# Altium project HSBNE-INPUT.PrjPcb
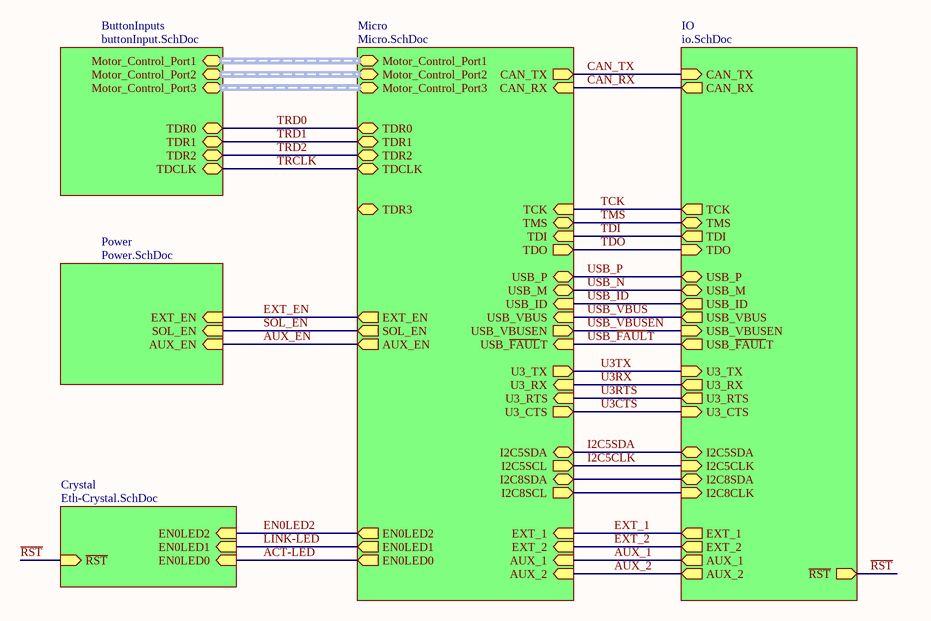
[diagram p0: Main.SchDoc]
6 sheets, 108 parts. Net scope: hierarchical (ports join the sheet entries above them; power ports are global).
Board file: HSBNE-IO.PcbDoc
Sheets:
  Main.SchDoc
    ButtonInputs = buttonInput.SchDoc
    Micro = Micro.SchDoc
    Power = Power.SchDoc
    Crystal = Eth-Crystal.SchDoc
    IO = io.SchDoc

## Sheet Main.SchDoc
size A

### Sub-sheets
ButtonInputs = buttonInput.SchDoc: Motor_Control_Port1 (harness MCP), Motor_Control_Port2 (harness MCP), Motor_Control_Port3 (harness MCP), TDR0 (bidir), TDR1 (bidir), TDR2 (bidir), TDCLK (bidir)
Crystal = Eth-Crystal.SchDoc: EN0LED0 (in), EN0LED1 (in), EN0LED2 (in), ~{RST} (in)
IO = io.SchDoc: CAN_TX (in), CAN_RX (out), TCK (out), TMS (bidir), TDI (out), TDO (in), U3_RTS (out), U3_CTS (in), U3_TX (in), U3_RX (out), USB_P (bidir), USB_M (bidir), USB_ID (out), ~{RST} (out), I2C5SDA (bidir), I2C5CLK (in), USB_VBUSEN (in), USB_~{FAUL}T (out), I2C8CLK (in), USB_VBUS (out), I2C8SDA (bidir), EXT_1 (out), AUX_1 (out), EXT_2 (out), AUX_2 (out)
Micro = Micro.SchDoc: AUX_EN (out), CAN_TX (out), CAN_RX (in), Motor_Control_Port1 (harness MCP), Motor_Control_Port2 (harness MCP), Motor_Control_Port3 (harness MCP), TCK (in), TMS (bidir), TDI (in), TDO (out), EN0LED0 (out), EN0LED1 (out), EN0LED2 (out), USB_P (bidir), USB_M (bidir), USB_ID (in), USB_VBUS (in), U3_TX (out), U3_RX (in), U3_RTS (in), U3_CTS (out), TDR3 (bidir), TDR0 (bidir), TDCLK (bidir), TDR2 (bidir), TDR1 (bidir), I2C5SDA (bidir), I2C5SCL (out), USB_VBUSEN (out), USB_~{FAUL}T (in), EXT_EN (out), SOL_EN (out), I2C8SDA (bidir), I2C8SCL (out), EXT_1 (in), EXT_2 (in), AUX_1 (in), AUX_2 (in)
Power = Power.SchDoc: AUX_EN (in), EXT_EN (in), SOL_EN (in)

### Nets
ACT-LED: sheet Micro/EN0LED0, sheet Crystal/EN0LED0
AUX_1: sheet Micro/AUX_1, sheet IO/AUX_1
AUX_2: sheet Micro/AUX_2, sheet IO/AUX_2
AUX_EN: sheet Micro/AUX_EN, sheet Power/AUX_EN
CAN_RX: sheet Micro/CAN_RX, sheet IO/CAN_RX  [project net CAN RX]
CAN_TX: sheet Micro/CAN_TX, sheet IO/CAN_TX  [project net CAN TX]
EN0LED2: sheet Micro/EN0LED2, sheet Crystal/EN0LED2
EXT_1: sheet Micro/EXT_1, sheet IO/EXT_1
EXT_2: sheet Micro/EXT_2, sheet IO/EXT_2
EXT_EN: sheet Micro/EXT_EN, sheet Power/EXT_EN
I2C5CLK: sheet Micro/I2C5SCL, sheet IO/I2C5CLK
I2C5SDA: sheet Micro/I2C5SDA, sheet IO/I2C5SDA
I2C8CLK: sheet Micro/I2C8SCL, sheet IO/I2C8CLK
I2C8SDA: sheet Micro/I2C8SDA, sheet IO/I2C8SDA
LINK-LED: sheet Micro/EN0LED1, sheet Crystal/EN0LED1
~{RST}: sheet Crystal/~{RST}, sheet IO/~{RST}
SOL_EN: sheet Micro/SOL_EN, sheet Power/SOL_EN
TCK: sheet Micro/TCK, sheet IO/TCK
TDI: sheet Micro/TDI, sheet IO/TDI
TDO: sheet Micro/TDO, sheet IO/TDO
TMS: sheet Micro/TMS, sheet IO/TMS
TRCLK: sheet ButtonInputs/TDCLK, sheet Micro/TDCLK
TRD0: sheet ButtonInputs/TDR0, sheet Micro/TDR0
TRD1: sheet ButtonInputs/TDR1, sheet Micro/TDR1
TRD2: sheet ButtonInputs/TDR2, sheet Micro/TDR2
U3CTS: sheet Micro/U3_CTS, sheet IO/U3_CTS
U3RTS: sheet Micro/U3_RTS, sheet IO/U3_RTS
U3RX: sheet Micro/U3_RX, sheet IO/U3_RX
U3TX: sheet Micro/U3_TX, sheet IO/U3_TX
USB_~{FAUL}T: sheet Micro/USB_~{FAUL}T, sheet IO/USB_~{FAUL}T  [project net ~{FAULT}]
USB_ID: sheet Micro/USB_ID, sheet IO/USB_ID
USB_N: sheet Micro/USB_M, sheet IO/USB_M
USB_P: sheet Micro/USB_P, sheet IO/USB_P
USB_VBUS: sheet Micro/USB_VBUS, sheet IO/USB_VBUS
USB_VBUSEN: sheet Micro/USB_VBUSEN, sheet IO/USB_VBUSEN

### Buses and harness runs
harness sheet ButtonInputs/Motor_Control_Port1 = sheet Micro/Motor_Control_Port1
harness sheet ButtonInputs/Motor_Control_Port2 = sheet Micro/Motor_Control_Port2
harness sheet ButtonInputs/Motor_Control_Port3 = sheet Micro/Motor_Control_Port3

## Sheet buttonInput.SchDoc
size A
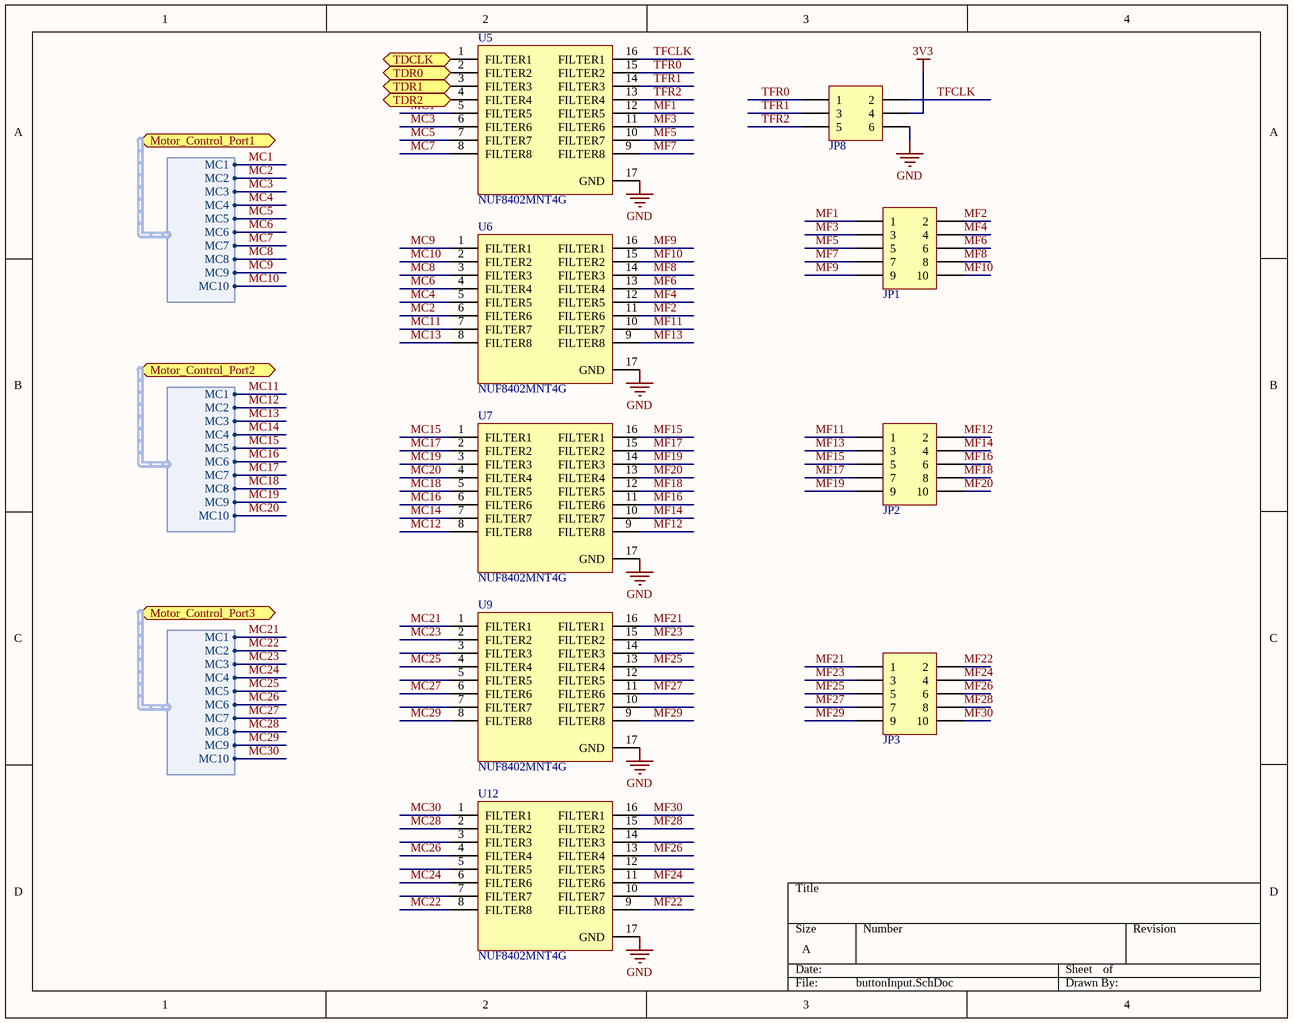
[diagram p1: buttonInput.SchDoc]

### Parts
JP1  Header 5x2 2.54mm  [2X5]  (value not drawn)
JP2  Header 5x2 2.54mm  [2X5]  (value not drawn)
JP3  Header 5x2 2.54mm  [2X5]  (value not drawn)
JP8  Header 3x2 2.54mm  [2X3]  (value not drawn)
U5  NUF8402MNT4G  [ONSC-DFN-16-506AC_V]
U6  NUF8402MNT4G  [ONSC-DFN-16-506AC_V]
U7  NUF8402MNT4G  [ONSC-DFN-16-506AC_V]
U9  NUF8402MNT4G  [ONSC-DFN-16-506AC_V]
U12  NUF8402MNT4G  [ONSC-DFN-16-506AC_V]

### Ports
Motor_Control_Port1 (harness MCP), Motor_Control_Port2 (harness MCP), Motor_Control_Port3 (harness MCP), TDCLK (bidir), TDR0 (bidir), TDR1 (bidir), TDR2 (bidir)

### Harnesses
MCP: MC1, MC2, MC3, MC4, MC5, MC6, MC7, MC8, MC9, MC10

### Nets
3V3: JP8.4
GND: JP8.6 U5.17(GND) U6.17(GND) U7.17(GND) U9.17(GND) U12.17(GND)
MC1: U5.5(FILTER5) ; port Motor_Control_Port1.MC1
MC2: U6.6(FILTER6) ; port Motor_Control_Port1.MC2
MC3: U5.6(FILTER6) ; port Motor_Control_Port1.MC3
MC4: U6.5(FILTER5) ; port Motor_Control_Port1.MC4
MC5: U5.7(FILTER7) ; port Motor_Control_Port1.MC5
MC6: U6.4(FILTER4) ; port Motor_Control_Port1.MC6
MC7: U5.8(FILTER8) ; port Motor_Control_Port1.MC7
MC8: U6.3(FILTER3) ; port Motor_Control_Port1.MC8
MC9: U6.1(FILTER1) ; port Motor_Control_Port1.MC9
MC10: U6.2(FILTER2) ; port Motor_Control_Port1.MC10
MC11: U6.7(FILTER7) ; port Motor_Control_Port2.MC1
MC12: U7.8(FILTER8) ; port Motor_Control_Port2.MC2
MC13: U6.8(FILTER8) ; port Motor_Control_Port2.MC3
MC14: U7.7(FILTER7) ; port Motor_Control_Port2.MC4
MC15: U7.1(FILTER1) ; port Motor_Control_Port2.MC5
MC16: U7.6(FILTER6) ; port Motor_Control_Port2.MC6
MC17: U7.2(FILTER2) ; port Motor_Control_Port2.MC7
MC18: U7.5(FILTER5) ; port Motor_Control_Port2.MC8
MC19: U7.3(FILTER3) ; port Motor_Control_Port2.MC9
MC20: U7.4(FILTER4) ; port Motor_Control_Port2.MC10
MC21: U9.1(FILTER1) ; port Motor_Control_Port3.MC1
MC22: U12.8(FILTER8) ; port Motor_Control_Port3.MC2
MC23: U9.2(FILTER2) ; port Motor_Control_Port3.MC3
MC24: U12.6(FILTER6) ; port Motor_Control_Port3.MC4
MC25: U9.4(FILTER4) ; port Motor_Control_Port3.MC5
MC26: U12.4(FILTER4) ; port Motor_Control_Port3.MC6
MC27: U9.6(FILTER6) ; port Motor_Control_Port3.MC7
MC28: U12.2(FILTER2) ; port Motor_Control_Port3.MC8
MC29: U9.8(FILTER8) ; port Motor_Control_Port3.MC9
MC30: U12.1(FILTER1) ; port Motor_Control_Port3.MC10
MF1: JP1.1 U5.12(FILTER5)
MF2: JP1.2 U6.11(FILTER6)
MF3: JP1.3 U5.11(FILTER6)
MF4: JP1.4 U6.12(FILTER5)
MF5: JP1.5 U5.10(FILTER7)
MF6: JP1.6 U6.13(FILTER4)
MF7: JP1.7 U5.9(FILTER8)
MF8: JP1.8 U6.14(FILTER3)
MF9: JP1.9 U6.16(FILTER1)
MF10: JP1.10 U6.15(FILTER2)
MF11: JP2.1 U6.10(FILTER7)
MF12: JP2.2 U7.9(FILTER8)
MF13: JP2.3 U6.9(FILTER8)
MF14: JP2.4 U7.10(FILTER7)
MF15: JP2.5 U7.16(FILTER1)
MF16: JP2.6 U7.11(FILTER6)
MF17: JP2.7 U7.15(FILTER2)
MF18: JP2.8 U7.12(FILTER5)
MF19: JP2.9 U7.14(FILTER3)
MF20: JP2.10 U7.13(FILTER4)
MF21: JP3.1 U9.16(FILTER1)
MF22: JP3.2 U12.9(FILTER8)
MF23: JP3.3 U9.15(FILTER2)
MF24: JP3.4 U12.11(FILTER6)
MF25: JP3.5 U9.13(FILTER4)
MF26: JP3.6 U12.13(FILTER4)
MF27: JP3.7 U9.11(FILTER6)
MF28: JP3.8 U12.15(FILTER2)
MF29: JP3.9 U9.9(FILTER8)
MF30: JP3.10 U12.16(FILTER1)
TFCLK: JP8.2 U5.16(FILTER1)
TFR0: JP8.1 U5.15(FILTER2)
TFR1: JP8.3 U5.14(FILTER3)
TFR2: JP8.5 U5.13(FILTER4)
TRCLK: U5.1(FILTER1) ; port TDCLK
TRD0: U5.2(FILTER2) ; port TDR0
TRD1: U5.3(FILTER3) ; port TDR1
TRD2: U5.4(FILTER4) ; port TDR2

Not connected (* = marked no-connect by the designer): U9 3(FILTER3) 5(FILTER5) 7(FILTER7) 10(FILTER7) 12(FILTER5) 14(FILTER3); U12 3(FILTER3) 5(FILTER5) 7(FILTER7) 10(FILTER7) 12(FILTER5) 14(FILTER3)

### Library data of the parts
JP1-JP3 = Header 5x2: Header, 8-Pin; Supplier 1: Farnell; Supplier Part Number 1: 1593440
JP8 = Header 3x2: Header, 6-Pin; Supplier 1: Digi-Key; Supplier 2: Mouser; Supplier Part Number 1: 952-1788-ND; Supplier Part Number 2: 855-M20-9980446
U5-U7 U9 U12 = CMP-1065-00001-1: 8-Channel EMI Filter with Integrated ESD Protection, -40 to 85 degC, 16-Pin DFN, Pb-Free, Tape and Reel; Manufacturer: On Semiconductor; V(BR) Typ (V): 7; Number of Lines: 8; VRWM Max (V): 5; ComponentLink3URL: http://www.onsemi.com/pub_link/Collateral/506AC.PDF; PackageVersion: Rev. D, 08/2013; RoHS: Pb-Free; ComponentLink2URL: http://www.onsemi.com/pub/Collateral/NUF8402MN-D.PDF; Packing: Tape and Reel; Mounting Technology: Surface Mount; ComponentLink1URL: http://www.onsemi.com/; PackageDescription: 16-Pin Small Outline No-Lead, Body 4 x 1.6 mm, Pitch 0.5 mm; DatasheetVersion: Rev. 7; ComponentLink3Description: Package Specification; PackageReference: DFN-16-506AC; ComponentLink2Description: Datasheet; ComponentLink1Description: Manufacturer URL; PartNumber: NUF8402MNT4G

## Sheet Micro.SchDoc
size A
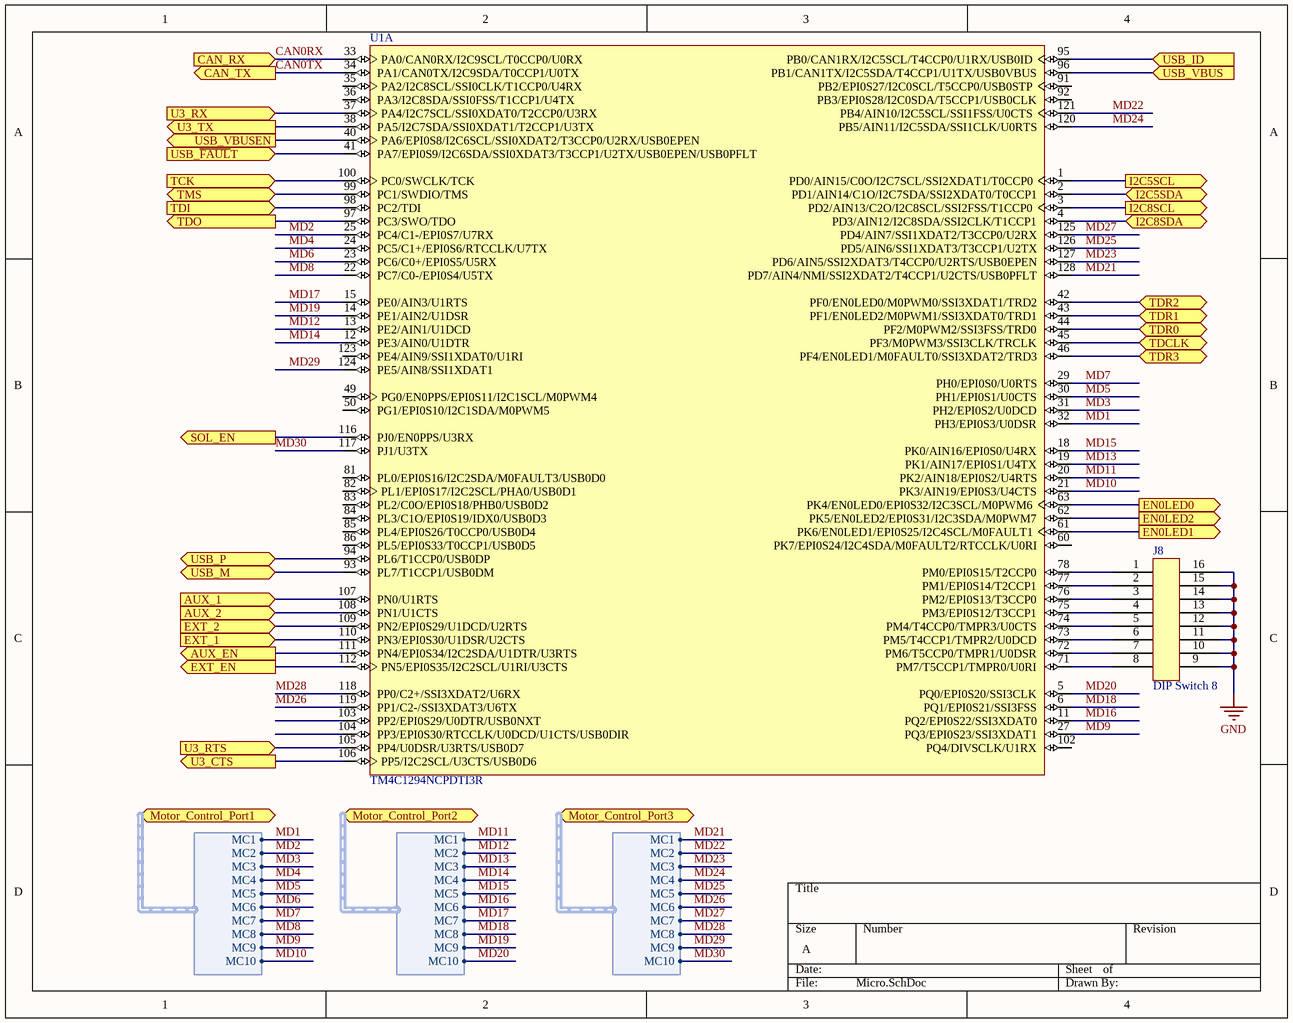
[diagram p2: Micro.SchDoc]

### Parts
J8  DIP Switch 8  [DIP8]
U1  TM4C1294NCPDTI3R  [TI-PDT128_M]  (part A of 3)

### Ports
AUX_1 (in), AUX_2 (in), AUX_EN (out), CAN_RX (in), CAN_TX (out), EN0LED0 (out), EN0LED1 (out), EN0LED2 (out), EXT_1 (in), EXT_2 (in), EXT_EN (out), I2C5SCL (out), I2C5SDA (bidir), I2C8SCL (out), I2C8SDA (bidir), Motor_Control_Port1 (harness MCP), Motor_Control_Port2 (harness MCP), Motor_Control_Port3 (harness MCP), SOL_EN (out), TCK (in), TDCLK (bidir), TDI (in), TDO (out), TDR0 (bidir), TDR1 (bidir), TDR2 (bidir), TDR3 (bidir), TMS (bidir), U3_CTS (out), U3_RTS (in), U3_RX (in), U3_TX (out), USB_ID (in), USB_M (bidir), USB_P (bidir), USB_VBUS (in), USB_VBUSEN (out), USB_~{FAUL}T (in)

### Harnesses
MCP: MC1, MC2, MC3, MC4, MC5, MC6, MC7, MC8, MC9, MC10

### Nets
GND: J8.9 J8.10 J8.11 J8.12 J8.13 J8.14 J8.15 J8.16
ACT-LED: U1.63(PK4/EN0LED0/EPI0S32/I2C3SCL/M0PWM6) ; port EN0LED0
AUX_1: U1.107(PN0/U1RTS) ; port AUX_1
AUX_2: U1.108(PN1/U1CTS) ; port AUX_2
AUX_EN: U1.111(PN4/EPI0S34/I2C2SDA/U1DTR/U3RTS) ; port AUX_EN
CAN0RX: U1.33(PA0/CAN0RX/I2C9SCL/T0CCP0/U0RX) ; port CAN_RX  [project net CAN RX]
CAN0TX: U1.34(PA1/CAN0TX/I2C9SDA/T0CCP1/U0TX) ; port CAN_TX  [project net CAN TX]
EN0LED2: U1.62(PK5/EN0LED2/EPI0S31/I2C3SDA/M0PWM7) ; port EN0LED2
EXT_1: U1.110(PN3/EPI0S30/U1DSR/U2CTS) ; port EXT_1
EXT_2: U1.109(PN2/EPI0S29/U1DCD/U2RTS) ; port EXT_2
EXT_EN: U1.112(PN5/EPI0S35/I2C2SCL/U1RI/U3CTS) ; port EXT_EN
~{FAULT}: U1.41(PA7/EPI0S9/I2C6SDA/SSI0XDAT3/T3CCP1/U2TX/USB0EPEN/USB0PFLT) ; port USB_~{FAUL}T
I2C5CLK: U1.1(PD0/AIN15/C0O/I2C7SCL/SSI2XDAT1/T0CCP0) ; port I2C5SCL
I2C5SDA: U1.2(PD1/AIN14/C1O/I2C7SDA/SSI2XDAT0/T0CCP1) ; port I2C5SDA
I2C8CLK: U1.3(PD2/AIN13/C2O/I2C8SCL/SSI2FSS/T1CCP0) ; port I2C8SCL
I2C8SDA: U1.4(PD3/AIN12/I2C8SDA/SSI2CLK/T1CCP1) ; port I2C8SDA
LINK-LED: U1.61(PK6/EN0LED1/EPI0S25/I2C4SCL/M0FAULT1) ; port EN0LED1
MD1: U1.32(PH3/EPI0S3/U0DSR) ; port Motor_Control_Port1.MC1  [project net MC1]
MD2: U1.25(PC4/C1-/EPI0S7/U7RX) ; port Motor_Control_Port1.MC2  [project net MC2]
MD3: U1.31(PH2/EPI0S2/U0DCD) ; port Motor_Control_Port1.MC3  [project net MC3]
MD4: U1.24(PC5/C1+/EPI0S6/RTCCLK/U7TX) ; port Motor_Control_Port1.MC4  [project net MC4]
MD5: U1.30(PH1/EPI0S1/U0CTS) ; port Motor_Control_Port1.MC5  [project net MC5]
MD6: U1.23(PC6/C0+/EPI0S5/U5RX) ; port Motor_Control_Port1.MC6  [project net MC6]
MD7: U1.29(PH0/EPI0S0/U0RTS) ; port Motor_Control_Port1.MC7  [project net MC7]
MD8: U1.22(PC7/C0-/EPI0S4/U5TX) ; port Motor_Control_Port1.MC8  [project net MC8]
MD9: U1.27(PQ3/EPI0S23/SSI3XDAT1) ; port Motor_Control_Port1.MC9  [project net MC9]
MD10: U1.21(PK3/AIN19/EPI0S3/U4CTS) ; port Motor_Control_Port1.MC10  [project net MC10]
MD11: U1.20(PK2/AIN18/EPI0S2/U4RTS) ; port Motor_Control_Port2.MC1  [project net MC11]
MD12: U1.13(PE2/AIN1/U1DCD) ; port Motor_Control_Port2.MC2  [project net MC12]
MD13: U1.19(PK1/AIN17/EPI0S1/U4TX) ; port Motor_Control_Port2.MC3  [project net MC13]
MD14: U1.12(PE3/AIN0/U1DTR) ; port Motor_Control_Port2.MC4  [project net MC14]
MD15: U1.18(PK0/AIN16/EPI0S0/U4RX) ; port Motor_Control_Port2.MC5  [project net MC15]
MD16: U1.11(PQ2/EPI0S22/SSI3XDAT0) ; port Motor_Control_Port2.MC6  [project net MC16]
MD17: U1.15(PE0/AIN3/U1RTS) ; port Motor_Control_Port2.MC7  [project net MC17]
MD18: U1.6(PQ1/EPI0S21/SSI3FSS) ; port Motor_Control_Port2.MC8  [project net MC18]
MD19: U1.14(PE1/AIN2/U1DSR) ; port Motor_Control_Port2.MC9  [project net MC19]
MD20: U1.5(PQ0/EPI0S20/SSI3CLK) ; port Motor_Control_Port2.MC10  [project net MC20]
MD21: U1.128(PD7/AIN4/NMI/SSI2XDAT2/T4CCP1/U2CTS/USB0PFLT) ; port Motor_Control_Port3.MC1  [project net MC21]
MD22: U1.121(PB4/AIN10/I2C5SCL/SSI1FSS/U0CTS) ; port Motor_Control_Port3.MC2  [project net MC22]
MD23: U1.127(PD6/AIN5/SSI2XDAT3/T4CCP0/U2RTS/USB0EPEN) ; port Motor_Control_Port3.MC3  [project net MC23]
MD24: U1.120(PB5/AIN11/I2C5SDA/SSI1CLK/U0RTS) ; port Motor_Control_Port3.MC4  [project net MC24]
MD25: U1.126(PD5/AIN6/SSI1XDAT3/T3CCP1/U2TX) ; port Motor_Control_Port3.MC5  [project net MC25]
MD26: U1.119(PP1/C2-/SSI3XDAT3/U6TX) ; port Motor_Control_Port3.MC6  [project net MC26]
MD27: U1.125(PD4/AIN7/SSI1XDAT2/T3CCP0/U2RX) ; port Motor_Control_Port3.MC7  [project net MC27]
MD28: U1.118(PP0/C2+/SSI3XDAT2/U6RX) ; port Motor_Control_Port3.MC8  [project net MC28]
MD29: U1.124(PE5/AIN8/SSI1XDAT1) ; port Motor_Control_Port3.MC9  [project net MC29]
MD30: U1.117(PJ1/U3TX) ; port Motor_Control_Port3.MC10  [project net MC30]
SOL_EN: U1.116(PJ0/EN0PPS/U3RX) ; port SOL_EN
TCK: U1.100(PC0/SWCLK/TCK) ; port TCK
TDI: U1.98(PC2/TDI) ; port TDI
TDO: U1.97(PC3/SWO/TDO) ; port TDO
TMS: U1.99(PC1/SWDIO/TMS) ; port TMS
TRCLK: U1.45(PF3/M0PWM3/SSI3CLK/TRCLK) ; port TDCLK
TRD0: U1.44(PF2/M0PWM2/SSI3FSS/TRD0) ; port TDR0
TRD1: U1.43(PF1/EN0LED2/M0PWM1/SSI3XDAT0/TRD1) ; port TDR1
TRD2: U1.42(PF0/EN0LED0/M0PWM0/SSI3XDAT1/TRD2) ; port TDR2
U3CTS: U1.106(PP5/I2C2SCL/U3CTS/USB0D6) ; port U3_CTS
U3RTS: U1.105(PP4/U0DSR/U3RTS/USB0D7) ; port U3_RTS
U3RX: U1.37(PA4/I2C7SCL/SSI0XDAT0/T2CCP0/U3RX) ; port U3_RX
U3TX: U1.38(PA5/I2C7SDA/SSI0XDAT1/T2CCP1/U3TX) ; port U3_TX
USB_ID: U1.95(PB0/CAN1RX/I2C5SCL/T4CCP0/U1RX/USB0ID) ; port USB_ID
USB_N: U1.93(PL7/T1CCP1/USB0DM) ; port USB_M
USB_P: U1.94(PL6/T1CCP0/USB0DP) ; port USB_P
USB_VBUS: U1.96(PB1/CAN1TX/I2C5SDA/T4CCP1/U1TX/USB0VBUS) ; port USB_VBUS
USB_VBUSEN: U1.40(PA6/EPI0S8/I2C6SCL/SSI0XDAT2/T3CCP0/U2RX/USB0EPEN) ; port USB_VBUSEN
NetJ8_1: J8.1 U1.78(PM0/EPI0S15/T2CCP0)
NetJ8_2: J8.2 U1.77(PM1/EPI0S14/T2CCP1)
NetJ8_3: J8.3 U1.76(PM2/EPI0S13/T3CCP0)
NetJ8_4: J8.4 U1.75(PM3/EPI0S12/T3CCP1)
NetJ8_5: J8.5 U1.74(PM4/T4CCP0/TMPR3/U0CTS)
NetJ8_6: J8.6 U1.73(PM5/T4CCP1/TMPR2/U0DCD)
NetJ8_7: J8.7 U1.72(PM6/T5CCP0/TMPR1/U0DSR)
NetJ8_8: J8.8 U1.71(PM7/T5CCP1/TMPR0/U0RI)
NetU1_46: U1.46(PF4/EN0LED1/M0FAULT0/SSI3XDAT2/TRD3) ; port TDR3

Not connected (* = marked no-connect by the designer): U1 35(PA2/I2C8SCL/SSI0CLK/T1CCP0/U4RX) 36(PA3/I2C8SDA/SSI0FSS/T1CCP1/U4TX) 49(PG0/EN0PPS/EPI0S11/I2C1SCL/M0PWM4) 50(PG1/EPI0S10/I2C1SDA/M0PWM5) 60(PK7/EPI0S24/I2C4SDA/M0FAULT2/RTCCLK/U0RI) 81(PL0/EPI0S16/I2C2SDA/M0FAULT3/USB0D0) 82(PL1/EPI0S17/I2C2SCL/PHA0/USB0D1) 83(PL2/C0O/EPI0S18/PHB0/USB0D2) 84(PL3/C1O/EPI0S19/IDX0/USB0D3) 85(PL4/EPI0S26/T0CCP0/USB0D4) 86(PL5/EPI0S33/T0CCP1/USB0D5) 91(PB2/EPI0S27/I2C0SCL/T5CCP0/USB0STP) 92(PB3/EPI0S28/I2C0SDA/T5CCP1/USB0CLK) 102(PQ4/DIVSCLK/U1RX) 103(PP2/EPI0S29/U0DTR/USB0NXT) 104(PP3/EPI0S30/RTCCLK/U0DCD/U1CTS/USB0DIR) 123(PE4/AIN9/SSI1XDAT0/U1RI)

### Library data of the parts
J8 = DIP8: Supplier 1: Digikey; Supplier Part Number 1: CT3111-ND
U1 = CMP-0945-00007-1: Tiva C Series Microcontroller, 1024 KB Flash, 256 KB SRAM, 12 Bit, 20 Channels, -40 to 85 degC, 128-Pin TQFP (PDT), Green (RoHS & no Sb/Br), Tape and Reel; Manufacturer: Texas Instruments; SRAM: 256 KB; ADC Resolution: 12 Bits; ADC Channels: 20; Flash: 1024 KB; Max Speed: 120 MHz; CPU: ARM Cortex-M4; Packing: Tape and Reel; Mounting Technology: Surface Mount; Eco-Plan: Green (RoHS & no Sb/Br); ComponentLink1URL: http://www.ti.com/; ComponentLink3Description: Package Specification; ComponentLink2Description: Datasheet; PartNumber: TM4C1294NCPDTI3R; DatasheetVersion: 15863.2743; ComponentLink1Description: Manufacturer URL; ComponentLink3URL: http://www.ti.com/lit/ml/mpqf013/mpqf013.pdf; Temperature Range: -40 to 85 degC; ComponentLink2URL: http://www.ti.com/lit/ds/symlink/tm4c1294ncpdt.pdf; PackageVersion: 4087726/A; PackageDescription: 128-Pin Thin Quad Flat Package, Body 14 x 14 mm, Pitch 0.4 mm

## Sheet Power.SchDoc
size A
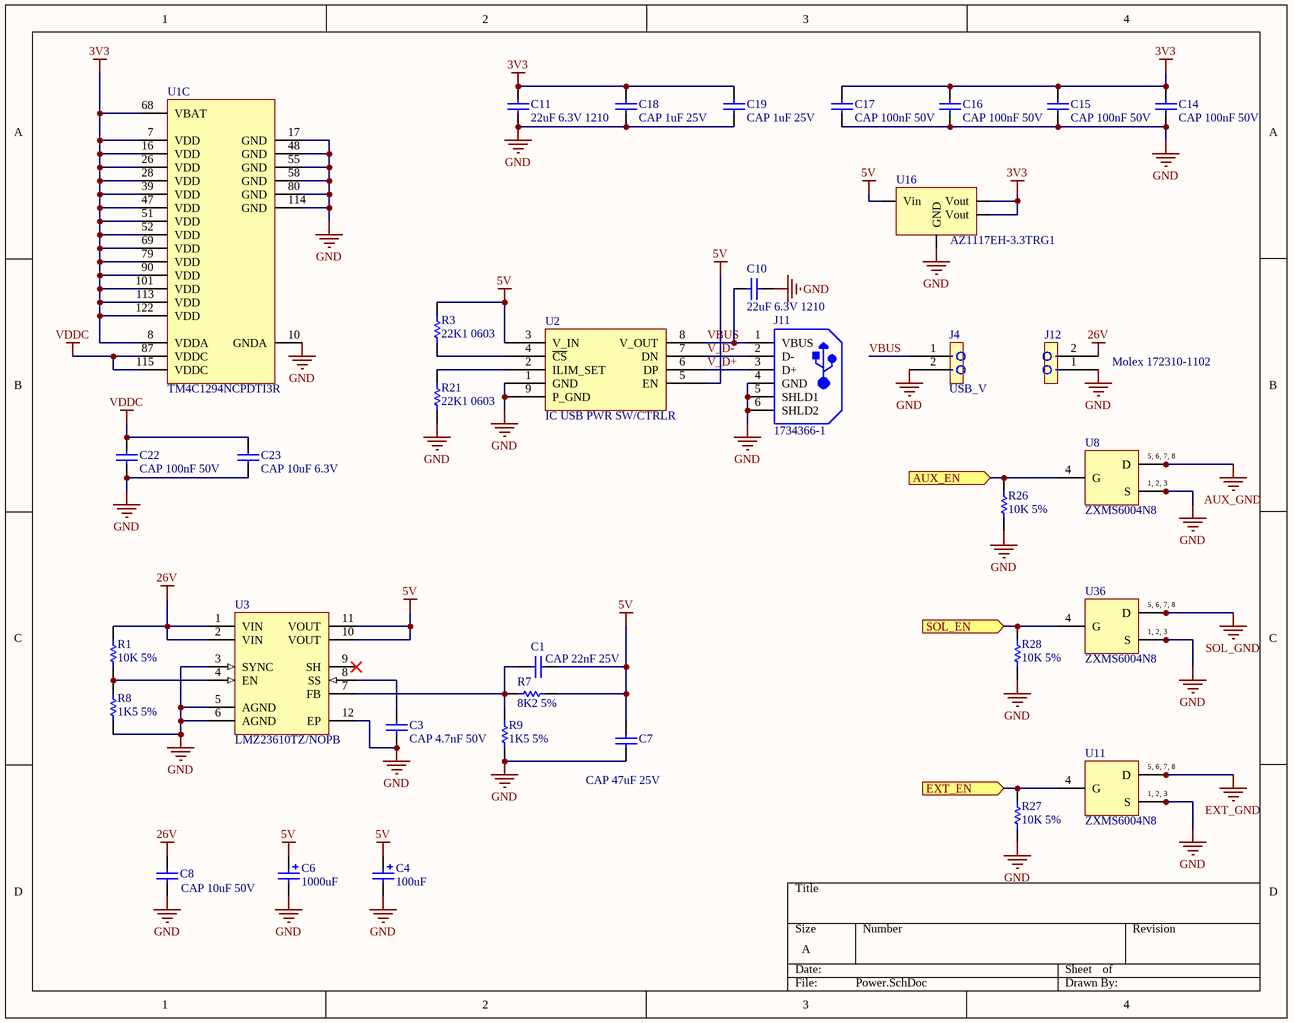
[diagram p3: Power.SchDoc]

### Parts
C1  CAP 22nF 25V  [CAPC0805(2012)100_M]
C3  CAP 4.7nF 50V  [CAPC0603(1608)100_M]
C4  100uF  [PANASONIC_C]
C6  1000uF  [PANASONIC_H13]
C7  CAP 47uF 25V  [CAPC1206(3216)100_L]
C8  CAP 10uF 50V  [CAPC1206(3216)190_M]
C10  22uF 6.3V 1210  [CAPC1210(3225)220_N]
C11  22uF 6.3V 1210  [CAPC1210(3225)220_N]
C14  CAP 100nF 50V  [CAPC0603(1608)100_M]
C15  CAP 100nF 50V  [CAPC0603(1608)100_M]
C16  CAP 100nF 50V  [CAPC0603(1608)100_M]
C17  CAP 100nF 50V  [CAPC0603(1608)100_M]
C18  CAP 1uF 25V  [CAPC0603(1608)100_M]
C19  CAP 1uF 25V  [CAPC0603(1608)100_M]
C22  CAP 100nF 50V  [CAPC0603(1608)100_M]
C23  CAP 10uF 6.3V  [CAPC0603(1608)100_M]
J4  USB_V  [1X2]
J11  1734366-1  [TE-1734366-1_V]
J12  Molex 172310-1102  [Molex 172310-1102]
R1  10K 5%  [RESC0603(1608)_M]
R3  22K1 0603  [RESC0603(1608)_N]
R7  8K2 5%  [RESC0603(1608)_M]
R8  1K5 5%  [RESC0603(1608)_M]
R9  1K5 5%  [RESC0603(1608)_M]
R21  22K1 0603  [RESC0603(1608)_N]
R26  10K 5%  [RESC0603(1608)_N]
R27  10K 5%  [RESC0603(1608)_N]
R28  10K 5%  [RESC0603(1608)_N]
U1  TM4C1294NCPDTI3R  [TI-PDT128_M]  (part C of 3)
U2  IC USB PWR SW/CTRLR  [8-MSOP-PowerPad]
U3  LMZ23610TZ/NOPB  [NDY0011A_M]
U8  ZXMS6004N8  [SO-8]
U11  ZXMS6004N8  [SO-8]
U16  AZ1117EH-3.3TRG1  [SOT-223]
U36  ZXMS6004N8  [SO-8]

### Ports
AUX_EN (in), EXT_EN (in), SOL_EN (in)

### Nets
3V3: C11.2 C14.2 C15.2 C16.2 C17.2 C18.2 C19.2 U1.7(VDD) U1.8(VDDA) U1.16(VDD) U1.26(VDD) U1.28(VDD) U1.39(VDD) U1.47(VDD) U1.51(VDD) U1.52(VDD) U1.68(VBAT) U1.69(VDD) U1.79(VDD) U1.90(VDD) U1.101(VDD) U1.113(VDD) U1.122(VDD) U16.2(Vout) U16.4(Vout)
5V: C1.2 C4.+ C6.+ C7.1 R3.1 R7.1 U2.3(V_IN) U2.5(EN) U3.10(VOUT) U3.11(VOUT) U16.3(Vin)
26V: C8.1 J12.2 R1.2 U3.1(VIN) U3.2(VIN)
AUX_GND: U8.5(D) U8.6(D) U8.7(D) U8.8(D)
EXT_GND: U11.5(D) U11.6(D) U11.7(D) U11.8(D)
GND: C3.1 C4.- C6.- C7.2 C8.2 C10.2 C11.1 C14.1 C15.1 C16.1 C17.1 C18.1 C19.1 C22.1 C23.1 J4.2 J11.4(GND) J11.5(SHLD1) J11.6(SHLD2) J12.1 R8.1 R9.1 R21.1 R26.1 R27.1 R28.1 U1.10(GNDA) U1.17(GND) U1.48(GND) U1.55(GND) U1.58(GND) U1.80(GND) U1.114(GND) U2.1(GND) U2.9(P_GND) U3.3(SYNC) U3.5(AGND) U3.6(AGND) U3.12(EP) U8.1(S) U8.2(S) U8.3(S) U11.1(S) U11.2(S) U11.3(S) U16.1(GND) U36.1(S) U36.2(S) U36.3(S)
SOL_GND: U36.5(D) U36.6(D) U36.7(D) U36.8(D)
VDDC: C22.2 C23.2 U1.87(VDDC) U1.115(VDDC)
AUX_EN: R26.2 U8.4(G) ; port AUX_EN
EXT_EN: R27.2 U11.4(G) ; port EXT_EN
SOL_EN: R28.2 U36.4(G) ; port SOL_EN
V_D+: J11.3(D+) U2.6(DP)
V_D-: J11.2(D-) U2.7(DN)
VBUS: C10.1 J4.1 J11.1(VBUS) U2.8(V_OUT)
NetC1_1: C1.1 R7.2 R9.2 U3.7(FB)
NetC3_2: C3.2 U3.8(SS)
NetR1_1: R1.1 R8.2 U3.4(EN)
NetR3_2: R3.2 U2.4(~{CS})
NetR21_2: R21.2 U2.2(ILIM_SET)

Not connected (* = marked no-connect by the designer): U3 9(SH)*

### Notes on the sheet
- (in symbol ZXMS6004N8) 5, 6, 7, 8; 1, 2, 3

### Library data of the parts
C1 = CMP-1036-04051-1: CAP 22nF 25V Â±5% 0805 (2012 Metric) Thickness 1mm SMD; Case-Metric: 2012; Case-EIA: 0805; Technology: SMT; Max Thickness: 1 mm; Value: 22nF; Rated Voltage: 25 V; Tolerance: Â±5%
C3 = CMP-1035-00333-1: CAP 4.7nF 50V Â±20% 0603 (1608 Metric) Thickness 1mm SMD; Case-EIA: 0603; Case-Metric: 1608; Max Thickness: 1 mm; Rated Voltage: 50 V; Technology: SMT; Tolerance: Â±20%; Value: 4.7nF
C4 = Cap_Polarized_100uF: Polarized Capacitor (Surface Mount); Published: 8-Jun-2000; LatestRevisionDate: 29-May-2009; LatestRevisionNote: IPC-7351 Footprint Added.; PackageReference: C0805; Publisher: Altium Limited; PackageDescription: Chip Capacitor; Value: 100uF; Supplier 1: Digi-Key; Supplier 2: Mouser; Supplier Part Number 1: PCE4718CT-ND; Supplier Part Number 2: 667-EEE-HAJ101WAR
C6 = Cap_Polarized_1000uF: Polarized Capacitor (Surface Mount); Published: 8-Jun-2000; LatestRevisionDate: 29-May-2009; LatestRevisionNote: IPC-7351 Footprint Added.; PackageReference: C0805; Publisher: Altium Limited; PackageDescription: Chip Capacitor; Value: 1000uF; Supplier 1: Digi-Key; Supplier 2: Mouser; Supplier Part Number 1: PCE3462CT-ND; Supplier Part Number 2: 140-VE102M1ETR1313
C7 = CMP-1037-00376-1: CAP 47uF 25V Â±0.25pF 1206 (3216 Metric) Thickness 1mm SMD; Case-EIA: 1206; Case-Metric: 3216; Technology: SMT; Max Thickness: 1 mm; Value: 47uF; Tolerance: Â±0.25pF; Rated Voltage: 25 V
C8 = CMP-1037-04982-1: CAP 10uF 50V Â±10% 1206 (3216 Metric) Thickness 1.9mm SMD; Case-EIA: 1206; Case-Metric: 3216; Technology: SMT; Tolerance: Â±10%; Max Thickness: 1.9 mm; Value: 10uF; Rated Voltage: 50 V
C10 C11 = CMP-1038-02259-1: CAP 22uF 6.3V ±10% 1210 (3225 Metric) Thickness 2.2mm SMD; Case-Metric: 3225; Case-EIA: 1210; Tolerance: Â±10%; Max Thickness: 2.2 mm; Rated Voltage: 6.3 V; Technology: SMT; Value: 22uF
C14-C17 C22 = CMP-1035-00010-1: CAP 100nF 50V Â±0.1pF 0603 (1608 Metric) Thickness 1mm SMD; Case-Metric: 1608; Case-EIA: 0603; Tolerance: Â±0.1pF; Technology: SMT; Value: 100nF; Max Thickness: 1 mm; Rated Voltage: 50 V
C18 C19 = CMP-1035-00037-1: CAP 1uF 25V Â±0.25pF 0603 (1608 Metric) Thickness 1mm SMD; Case-Metric: 1608; Case-EIA: 0603; Tolerance: Â±0.25pF; Max Thickness: 1 mm; Value: 1uF; Technology: SMT; Rated Voltage: 25 V
C23 = CMP-1035-02796-1: CAP 10uF 6.3V ±10% 0603 (1608 Metric) Thickness 1mm SMD; Case-EIA: 0603; Tolerance: Â±10%; Case-Metric: 1608; Value: 10uF; Technology: SMT; Rated Voltage: 6.3 V; Max Thickness: 1 mm
J4 J12 = CON2: 6.35mm right-angle 90° male spade terminal PCB mount; CID: 643; CID2: 643; CID3: 643
J11 = CMP-1684-00007-1: Recept Assy, Vertical, 4 Position, Thru-Hole, Type A USB, RoHS, Tray; Case\Package: SMA; Peak Reverse Current: 200 uA; Forward Voltage: 500 mV; Max Surge Current: 40 A; Max Operating Temperature: 125 degC; ComponentLink1URL: http://www.te.com/; Mount: Surface Mount; ComponentLink2URL: http://www.te.com/commerce/DocumentDelivery/DDEController?Action=showdoc&DocId=Customer+Drawing%7F1734366%7FC3%7Fpdf%7FEnglish%7FENG_CD_1734366_C3.pdf%7F1734366-1; ComponentLink2Description: Datasheet; Pins: 2; RoHSCompliant: true; REACH SVHC: No SVHC; Radiation Hardening: No; Min Operating Temperature: -65 degC; PackageReference: 1734366-1; PackageDescription: 6-Pin Through Hole Device, Length 15 mm, Height 15 mm, Tail Length 2.8 mm; ComponentLink1Description: Manufacturer URL; Package Quantity: 7500; DatasheetVersion: Rev. C3, 03/2016; Packaging: Tape and Reel
R1 R26-R28 = CMP-1012-00098-1: 10K 0.1W 5% 0603 (1608 Metric)  SMD; Case-EIA: 0603; Value: 10000.00 Ohm; Case-Metric: 1608; Technology: SMT; Tolerance: 5 %; Power: 0.1 W
R3 R21 = CMP-1012-00660-1: 22K1 0.1W 1% 0603 (1608 Metric)  SMD; Case-EIA: 0603; Case-Metric: 1608; Value: 22100.00 Ohm; Tolerance: 1 %; Power: 0.1 W; Technology: SMT
R7 = CMP-1012-00096-1: 8K2 0.1W 5% 0603 (1608 Metric)  SMD; Value: 8200.00 Ohm; Case-EIA: 0603; Case-Metric: 1608; Tolerance: 5 %; Technology: SMT; Power: 0.1 W
R8 R9 = CMP-1012-00078-1: 1K5 0.1W 5% 0603 (1608 Metric)  SMD; Case-Metric: 1608; Case-EIA: 0603; Value: 1500.00 Ohm; Technology: SMT; Power: 0.1 W; Tolerance: 5 %
U1 = CMP-0945-00007-1: as U1 on sheet Micro; Packing: Tape and Reel; Mounting Technology: Surface Mount; Eco-Plan: Green (RoHS & no Sb/Br); ComponentLink1URL: http://www.ti.com/; ComponentLink3Description: Package Specification; ComponentLink2Description: Datasheet; PartNumber: TM4C1294NCPDTI3R; DatasheetVersion: 15863.2743; ComponentLink1Description: Manufacturer URL; ComponentLink3URL: http://www.ti.com/lit/ml/mpqf013/mpqf013.pdf; Temperature Range: -40 to 85 degC; ComponentLink2URL: http://www.ti.com/lit/ds/symlink/tm4c1294ncpdt.pdf; PackageVersion: 4087726/A; PackageDescription: 128-Pin Thin Quad Flat Package, Body 14 x 14 mm, Pitch 0.4 mm; PartId: 2
U2 = IC USB PWR SW/CTRLR: USB Dedicated Charging Port, Power Switch; Supplier 1: Digikey; Supplier Part Number 1: 296-30552-1-ND
U3 = CMP-0069-02067-2: 10A SIMPLE SWITCHER® Power Module with 36V Maximum Input Voltage and Current Sharing, 11 pin TO-PMOD, 32 Rail; Manufacturer: Texas Instruments; PackageTopMarking: NSUZXYTTE#*LMZ23610; PowerWise: N; RoHS: Y; ComponentLink1Description: Datasheet URL; PinCount: 11; PackageDescription: TO-PMOD, 15 x 15 x 5.9 mm Body, 11 Lead, 1.27 mm Pitch, Surface Mount; ComponentLink1URL: http://www.ti.com/general/docs/lit/getliterature.tsp?genericPartNumber=LMZ23610&fileType=pdf; PackageReference: NDY0011A; CompType: Switcher
U8 U11 U36 = ZXMS6004N8: MOSFET N-CH 60V 1.3A S08; Manufacturer: On Semiconductor; PartNumber: NCV8402ASTT1G; Packing: Tape and Reel; Channel Polarity: N Channel; ComponentLink3Description: Package Specification; ComponentLink3URL: http://www.onsemi.com/pub_link/Collateral/318E-04.PDF; ComponentLink1URL: http://www.onsemi.com/; PackageDescription: 4-Pin Small Outline Transistor, Body 6.5 x 3.5 mm, Pitch 2.3 mm; DatasheetVersion: Rev. 8; ComponentLink1Description: Manufacturer URL; Mounting Technology: Surface Mount; PackageVersion: Rev. N, 08/2009; PackageReference: SOT-223-4-318E-04; ComponentLink2URL: http://www.onsemi.com/pub_link/Collateral/NCV8402-D.PDF; ComponentLink2Description: Datasheet; RoHS: Pb-Free
U16 = AZ1117EH: Reg 1A 3V3 OUT SIP VERT; Supplier 1: Digi-Key; Supplier Part Number 1: AZ1117EH-3.3TRG1DICT-ND

## Sheet Eth-Crystal.SchDoc
size A
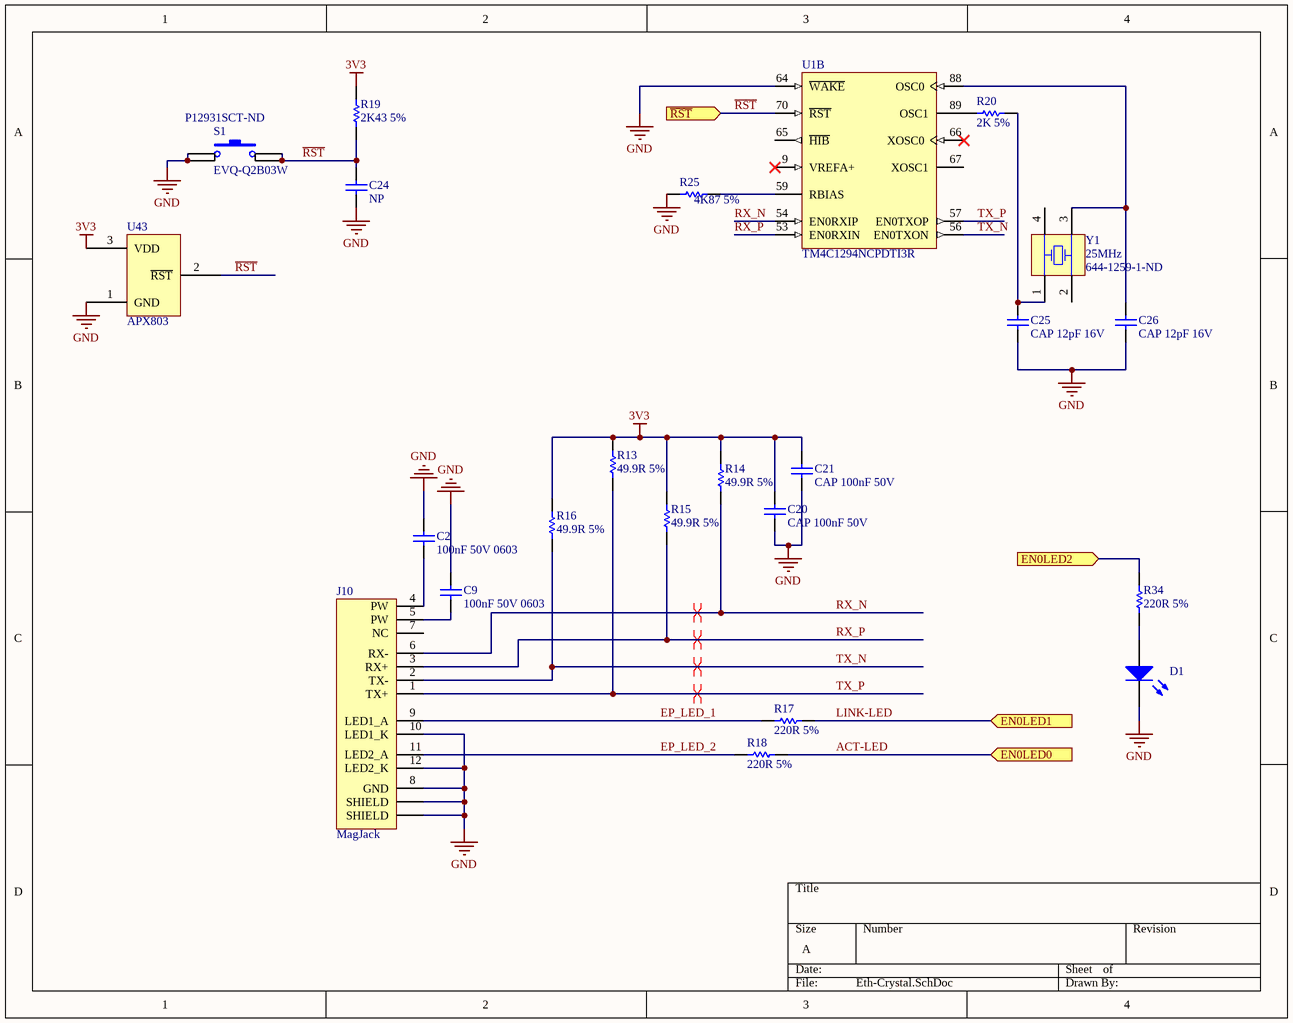
[diagram p4: Eth-Crystal.SchDoc]

### Parts
C2  100nF 50V 0603  [CAPC0603(1608)100_M]
C9  100nF 50V 0603  [CAPC0603(1608)100_M]
C20  CAP 100nF 50V  [CAPC0603(1608)100_M]
C21  CAP 100nF 50V  [CAPC0603(1608)100_M]
C24  NP  [0603]
C25  CAP 12pF 16V  [CAPC0603(1608)100_L]
C26  CAP 12pF 16V  [CAPC0603(1608)100_L]
D1  LED  [LED-0603]  (value not drawn)
J10  MagJack  [magjack]
R13  49.9R 5%  [RESC0603(1608)_M]
R14  49.9R 5%  [RESC0603(1608)_M]
R15  49.9R 5%  [RESC0603(1608)_M]
R16  49.9R 5%  [RESC0603(1608)_M]
R17  220R 5%  [RESC0603(1608)_M]
R18  220R 5%  [RESC0603(1608)_M]
R19  2K43 5%  [RESC0603(1608)_M]
R20  2K 5%  [RESC0603(1608)_N]
R25  4K87 5%  [RESC0603(1608)_M]
R34  220R 5%  [RESC0603(1608)_M]
S1  EVQ-Q2B03W  Supplier Part Number 1: P12931SCT-ND  [TACTILE_SWITCH_SMD]
U1  TM4C1294NCPDTI3R  [TI-PDT128_M]  (part B of 3)
U43  APX803  [SOT-23 - ESD]
Y1  Supplier Part Number 1: 644-1259-1-ND  [Crystal 3.2x2.5]  (hidden comment: 25MHz)

### Ports
EN0LED0 (in), EN0LED1 (in), EN0LED2 (in), ~{RST} (in)

### Nets
3V3: C20.2 C21.2 R13.2 R14.2 R15.2 R16.2 R19.2 U43.3(VDD)
GND: C2.2 C9.2 C20.1 C21.1 C24.1 C25.1 C26.1 D1.2(K) J10.8(GND) J10.10(LED1_K) J10.12(LED2_K) J10.GND1(SHIELD) J10.GND2(SHIELD) R25.1 S1.1 S1.2 U1.64(~{WAKE}) U43.1(GND)
ACT-LED: R18.2 ; port EN0LED0
EN0LED2: R34.2 ; port EN0LED2
EP_LED_1: J10.9(LED1_A) R17.1
EP_LED_2: J10.11(LED2_A) R18.1
LINK-LED: R17.2 ; port EN0LED1
~{RST}: C24.2 R19.1 S1.3 S1.4 U1.70(~{RST}) U43.2(~{RST}) ; port ~{RST}
RX_N: J10.6(RX-) R14.1 U1.54(EN0RXIP)
RX_P: J10.3(RX+) R15.1 U1.53(EN0RXIN)
TX_N: J10.2(TX-) R16.1 U1.56(EN0TXON)
TX_P: J10.1(TX+) R13.1 U1.57(EN0TXOP)
NetC2_1: C2.1 J10.4(PW)
NetC9_1: C9.1 J10.5(PW)
NetC25_2: C25.2 R20.2 Y1.1(OSC1)
NetC26_2: C26.2 U1.88(OSC0) Y1.3(OSC2)
NetD1_1: D1.1(A) R34.1
NetR20_1: R20.1 U1.89(OSC1)
NetR25_2: R25.2 U1.59(RBIAS)

Not connected (* = marked no-connect by the designer): J10 7(NC); U1 9(VREFA+)* 65(~{HIB}) 66(XOSC0)* 67(XOSC1); Y1 2(OSC2) 4(OSC1)

### Layout directives
differential pair: RX_N, RX_P, TX_N, TX_P

### Library data of the parts
C2 C9 = CMP-1035-02594-1: CAP 100nF 50V -20% to +80% 0603 (1608 Metric) Thickness 1mm SMD; Case-Metric: 1608; Case-EIA: 0603; Technology: SMT; Rated Voltage: 50 V; Value: 100nF; Max Thickness: 1 mm; Tolerance: -20% to +80%
C20 C21 = CMP-1035-00010-1: as C14 on sheet Power; Tolerance: Â±0.1pF; Technology: SMT; Value: 100nF; Max Thickness: 1 mm; Rated Voltage: 50 V
C24 = Cap_100pF: Capacitor (Semiconductor SIM Model); Value: 100pF; Published: 8-Jun-2000; LatestRevisionDate: 29-May-2009; LatestRevisionNote: IPC-7351 Footprint Added.; PackageReference: C1206; Publisher: Altium Limited; PackageDescription: Chip Capacitor
C25 C26 = CMP-1035-00602-1: CAP 12pF 16V Â±0.25pF 0603 (1608 Metric) Thickness 1mm SMD; Case-EIA: 0603; Case-Metric: 1608; Technology: SMT; Value: 12pF; Max Thickness: 1 mm; Rated Voltage: 16 V; Tolerance: Â±0.25pF
D1 = LED: Typical RED, GREEN, YELLOW, AMBER GaAs LED; Published: 8-Jun-2000; LatestRevisionDate: 17-Jul-2002; LatestRevisionNote: Re-released for DXP Platform.; PackageVersion: Feb-2002; PackageReference: 3.2X1.6X1.1; Publisher: Altium Limited; PackageDescription: SM LED; 2 Flat Leads; Supplier 1: Digi-Key; Supplier Part Number 1: 475-1409-1-ND; Supplier 2: Digikey; Supplier Part Number 2: SML-D12M1WT86TR-ND
R13-R16 = CMP-1012-00042-1: 49.9R 0.1W 5% 0603 (1608 Metric)  SMD; Value: 49.90 Ohm; Case-Metric: 1608; Case-EIA: 0603; Tolerance: 5 %; Technology: SMT; Power: 0.1 W
R17 R18 R34 = CMP-1012-00058-1: 220R 0.1W 5% 0603 (1608 Metric)  SMD; Case-EIA: 0603; Case-Metric: 1608; Value: 220.00 Ohm; Technology: SMT; Power: 0.1 W; Tolerance: 5 %
R19 = CMP-1012-00083-1: 2K43 0.1W 5% 0603 (1608 Metric)  SMD; Value: 2430.00 Ohm; Case-Metric: 1608; Case-EIA: 0603; Tolerance: 5 %; Technology: SMT; Power: 0.1 W
R20 = CMP-1012-00081-1: 2K 0.1W 5% 0603 (1608 Metric)  SMD; Case-Metric: 1608; Value: 2000.00 Ohm; Case-EIA: 0603; Tolerance: 5 %; Technology: SMT; Power: 0.1 W
R25 = CMP-1012-00090-1: 4K87 0.1W 5% 0603 (1608 Metric)  SMD; Case-Metric: 1608; Value: 4K87.00 Ohm; Case-EIA: 0603; Tolerance: 5 %; Technology: SMT; Power: 0.1 W
S1 = SW-PB: Switch; Published: 24-Mar-1999; LatestRevisionDate: 17-Jul-2002; LatestRevisionNote: Re-released for DXP Platform.; PackageReference: SPST-2; Publisher: Altium Limited; PackageDescription: Switch; 2 Leads; Supplier 1: Digi-Key
U1 = CMP-0945-00007-1: as U1 on sheet Micro; Packing: Tape and Reel; Mounting Technology: Surface Mount; Eco-Plan: Green (RoHS & no Sb/Br); ComponentLink1URL: http://www.ti.com/; ComponentLink3Description: Package Specification; ComponentLink2Description: Datasheet; PartNumber: TM4C1294NCPDTI3R; DatasheetVersion: 15863.2743; ComponentLink1Description: Manufacturer URL; ComponentLink3URL: http://www.ti.com/lit/ml/mpqf013/mpqf013.pdf; Temperature Range: -40 to 85 degC; ComponentLink2URL: http://www.ti.com/lit/ds/symlink/tm4c1294ncpdt.pdf; PackageVersion: 4087726/A; PackageDescription: 128-Pin Thin Quad Flat Package, Body 14 x 14 mm, Pitch 0.4 mm; PartId: 2
U43 = APX803: IC MPU RESET CIRC 3.08V SOT23R-3; Supplier 1: Digi-Key; Supplier Part Number 1: APX803-31SRG-7DICT-ND
Y1 = Crystal_25MHz: Surface Mount Quartz Crystal; Note: PCB layout complies with manufacturer's recommendation.; Published: 17-Jul-2002; DatasheetDocument: 28-Aug-2001; PackageDocument: 28-Aug-2001; PackageReference: 91SMX; Publisher: Altium Limited; ComponentLink1Description: Manufacturer Link; ComponentLink1URL: http://www.cmac.com/mt/; ComponentLink2Description: Datasheet; ComponentLink2URL: http://www.cmac.com/mt/databook/crystals/smd/90_91_smx.pdf; Value: 25MHz; Supplier 1: Digi-Key
J10 = MagJack: Supplier 1: Digikey; Supplier Part Number 1: ARJC02-111008B-ND

## Sheet io.SchDoc
size A
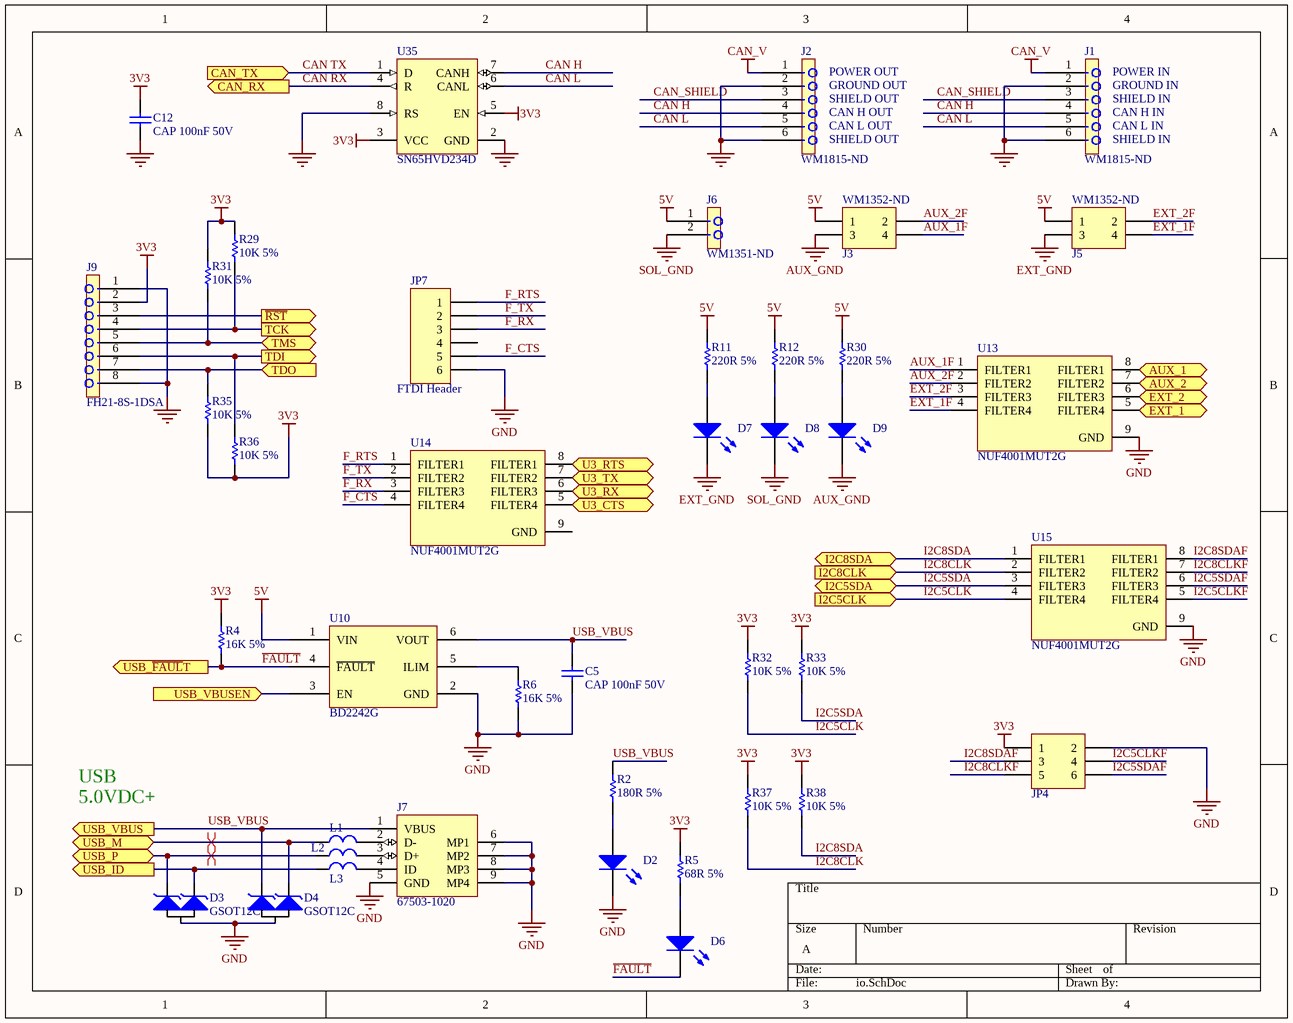
[diagram p5: io.SchDoc]

### Parts
C5  CAP 100nF 50V  [CAPC0603(1608)100_M]
C12  CAP 100nF 50V  [CAPC0603(1608)100_M]
D2  LED  [LED-0603]  (value not drawn)
D3  GSOT12C  [SOT-23 - ESD]
D4  GSOT12C  [SOT-23 - ESD]
D6  LED  [LED-0603]  (value not drawn)
D7  LED  [LED-0603]  (value not drawn)
D8  LED  [LED-0603]  (value not drawn)
D9  LED  [LED-0603]  (value not drawn)
J1  WM1815-ND  [M43045H-6]
J2  WM1815-ND  [M43045H-6]
J3  Supplier Part Number 1: WM1352-ND  [Molex 39-30-1040]  (hidden comment: Header 2x2 2.54mm)
J5  Supplier Part Number 1: WM1352-ND  [Molex 39-30-1040]  (hidden comment: Header 2x2 2.54mm)
J6  WM1351-ND  [M5569-2]
J7  67503-1020  [MOLX-67503-1020_V]
J9  FH21-8S-1DSA  [FH21-8S-1DSA]
JP4  Header 3x2 2.54mm  [2X3]  (value not drawn)
JP7  FTDI Header  [1X6]
L1  MPZ1608S102A  [0603]  (value not drawn)
L2  MPZ1608S102A  [0603]  (value not drawn)
L3  MPZ1608S102A  [0603]  (value not drawn)
R2  180R 5%  [RESC0603(1608)_L]
R4  16K 5%  [RESC0603(1608)_L]
R5  68R 5%  [RESC0603(1608)_M]
R6  16K 5%  [RESC0603(1608)_L]
R11  220R 5%  [RESC0603(1608)_M]
R12  220R 5%  [RESC0603(1608)_M]
R29  10K 5%  [RESC0603(1608)_N]
R30  220R 5%  [RESC0603(1608)_M]
R31  10K 5%  [RESC0603(1608)_N]
R32  10K 5%  [RESC0603(1608)_N]
R33  10K 5%  [RESC0603(1608)_N]
R35  10K 5%  [RESC0603(1608)_N]
R36  10K 5%  [RESC0603(1608)_N]
R37  10K 5%  [RESC0603(1608)_N]
R38  10K 5%  [RESC0603(1608)_N]
U10  BD2242G  [SOT23-6]
U13  NUF4001MUT2G  [ONSC-UDFN-8-517AD_V]
U14  NUF4001MUT2G  [ONSC-UDFN-8-517AD_V]
U15  NUF4001MUT2G  [ONSC-UDFN-8-517AD_V]
U35  SN65HVD234D  [D8_M]

### Ports
AUX_1 (out), AUX_2 (out), CAN_RX (out), CAN_TX (in), EXT_1 (out), EXT_2 (out), I2C5CLK (in), I2C5SDA (bidir), I2C8CLK (in), I2C8SDA (bidir), TCK (out), TDI (out), TDO (in), TMS (bidir), U3_CTS (in), U3_RTS (out), U3_RX (out), U3_TX (in), USB_ID (out), USB_M (bidir), USB_P (bidir), USB_VBUS (out), USB_VBUSEN (in), USB_~{FAUL}T (out), ~{RST} (out)

### Nets
3V3: C12.2 J9.2 JP4.1 R4.2 R5.2 R29.2 R31.2 R32.2 R33.2 R35.1 R36.1 R37.2 R38.2 U35.3(VCC) U35.5(EN)
5V: J3.1 J5.1 J6.1 R11.2 R12.2 R30.2 U10.1(VIN)
AUX_GND: D9.2(K) J3.3
CAN_V: J1.1 J2.1
EXT_GND: D7.2(K) J5.3
GND: C5.1 C12.1 D2.2(K) D3.3(A) D4.3(A) J1.2 J1.6 J2.2 J2.6 J7.5(GND) J7.6(MP1) J7.7(MP2) J7.8(MP3) J7.9(MP4) J9.1 J9.8 JP4.2 JP7.6 R6.1 U10.2(GND) U13.9(GND) U15.9(GND) U35.2(GND) U35.8(RS)
SOL_GND: D8.2(K) J6.2
AUX_1: U13.8(FILTER1) ; port AUX_1
AUX_1F: J3.4 U13.1(FILTER1)
AUX_2: U13.7(FILTER2) ; port AUX_2
AUX_2F: J3.2 U13.2(FILTER2)
CAN H: J1.4 J2.4 U35.7(CANH)
CAN L: J1.5 J2.5 U35.6(CANL)
CAN RX: U35.4(R) ; port CAN_RX
CAN TX: U35.1(D) ; port CAN_TX
CAN_SHIELD: J1.3 J2.3
EXT_1: U13.5(FILTER4) ; port EXT_1
EXT_1F: J5.4 U13.4(FILTER4)
EXT_2: U13.6(FILTER3) ; port EXT_2
EXT_2F: J5.2 U13.3(FILTER3)
~{FAULT}: D6.2(K) R4.1 U10.4(~{FAULT}) ; port USB_~{FAUL}T
F_CTS: JP7.5 U14.4(FILTER4)
F_RTS: JP7.1 U14.1(FILTER1)
F_RX: JP7.3 U14.3(FILTER3)
F_TX: JP7.2 U14.2(FILTER2)
I2C5CLK: R32.1 U15.4(FILTER4) ; port I2C5CLK
I2C5CLKF: JP4.4 U15.5(FILTER4)
I2C5SDA: R33.1 U15.3(FILTER3) ; port I2C5SDA
I2C5SDAF: JP4.6 U15.6(FILTER3)
I2C8CLK: R37.1 U15.2(FILTER2) ; port I2C8CLK
I2C8CLKF: JP4.5 U15.7(FILTER2)
I2C8SDA: R38.1 U15.1(FILTER1) ; port I2C8SDA
I2C8SDAF: JP4.3 U15.8(FILTER1)
~{RST}: J9.3 ; port ~{RST}
TCK: J9.4 R29.1 ; port TCK
TDI: J9.6 R36.2 ; port TDI
TDO: J9.7 R35.2 ; port TDO
TMS: J9.5 R31.1 ; port TMS
U3CTS: U14.5(FILTER4) ; port U3_CTS
U3RTS: U14.8(FILTER1) ; port U3_RTS
U3RX: U14.6(FILTER3) ; port U3_RX
U3TX: U14.7(FILTER2) ; port U3_TX
USB_ID: D3.2(K2) L3.1 ; port USB_ID
USB_N: D4.2(K2) L1.1 ; port USB_M
USB_P: D3.1(K1) L2.1 ; port USB_P
USB_VBUS: C5.2 D4.1(K1) J7.1(VBUS) R2.2 U10.6(VOUT) ; port USB_VBUS
USB_VBUSEN: U10.3(EN) ; port USB_VBUSEN
NetD2_1: D2.1(A) R2.1
NetD6_1: D6.1(A) R5.1
NetD7_1: D7.1(A) R11.1
NetD8_1: D8.1(A) R12.1
NetD9_1: D9.1(A) R30.1
NetJ7_2: J7.2(D-) L1.2
NetJ7_3: J7.3(D+) L2.2
NetJ7_4: J7.4(ID) L3.2
NetR6_2: R6.2 U10.5(ILIM)

Not connected (* = marked no-connect by the designer): JP7 4; U14 9(GND)

### Layout directives
differential pair: USB_N, USB_P

### Notes on the sheet
- (near J2) POWER OUT
- (near J2) GROUND OUT
- (near J2) SHIELD OUT
- (near J1) POWER IN
- (near J1) GROUND IN
- (near J1) SHIELD IN
- (near J2) CAN H OUT
- (near J2) CAN L OUT
- (near J1) CAN H IN
- (near J1) CAN L IN
- USB
- 5.0VDC+

### Library data of the parts
C5 C12 = CMP-1035-00010-1: as C14 on sheet Power; Tolerance: Â±0.1pF; Technology: SMT; Value: 100nF; Max Thickness: 1 mm; Rated Voltage: 50 V
D2 D6-D9 = LED: as D1 on sheet Eth-Crystal; Published: 8-Jun-2000; LatestRevisionDate: 17-Jul-2002; LatestRevisionNote: Re-released for DXP Platform.; PackageVersion: Feb-2002; PackageReference: 3.2X1.6X1.1; Publisher: Altium Limited; PackageDescription: SM LED; 2 Flat Leads; Supplier 1: Digi-Key; Supplier Part Number 1: 475-1409-1-ND; Supplier 2: Digikey; Supplier Part Number 2: SML-D12M1WT86TR-ND
D3 D4 = 2749: DIO GSOT12C ESD 2LINE 12V SOT23; MPN: GSOT12C-E3-08; COST1K: 0.11250; COST10: 0.3750; COST100: 0.25000; MAN: Vishay Semiconductor Diodes Division; SPN: GSOT12C-E3-08DKR-ND; Supplier: Digi-Key
J1 J2 = CON6: CID: 317; Supplier 1: Digikey; Supplier Part Number 1: WM1815-ND
J3 J5 = Header 2x2: Header, 4-Pin; Supplier 1: Digikey
J6 = CON2: as J4 on sheet Power; CID2: 643; CID3: 643; Supplier 1: Digikey; Supplier Part Number 1: WM1351-ND
J7 = CMP-0411-00002-1: USB, MINI, SMD, RA KME04-USBMU03A01; Manufacturer: Molex; ComponentLink1URL: http://www.molex.com/; PartNumber: 67503-1020; Mounting Technology: Surface Mount; ComponentLink1Description: Manufacturer URL; Terminal Pitch: 0.8 mm; DatasheetVersion: Rev F, 06/2009; ComponentLink2Description: Datasheet; PackageDescription: Mini USB Connector, SMT, Righer Angle; ComponentLink2URL: http://www.molex.com/pdm_docs/sd/675031020_sd.pdf; PackageReference: 67503-1020
J9 = CON8: CID: 238
JP4 = Header 3x2: Header, 6-Pin; Supplier 1: Digi-Key; Supplier 2: Mouser; Supplier Part Number 1: 952-1788-ND; Supplier Part Number 2: 855-M20-9980446
JP7 = Header 6: Header, 6-Pin; Supplier 1: Digi-Key; Supplier 2: Mouser; Supplier Part Number 1: 952-2270-ND; Supplier Part Number 2: 538-90120-1086
L1-L3 = 2982: IND FERRITE CHIP BEAD 1000 OHM @ 100MHz 800mA 0603; COST1K: 0.02717; COST10: 0.0790; COST100: 0.04720; MAN: TDK Corporation; SPN: 445-8694-6-ND; MPN: MPZ1608S102A; Supplier: Digi-Key
R2 = CMP-1012-00056-1: 180R 0.1W 5% 0603 (1608 Metric)  SMD; Value: 180.00 Ohm; Case-EIA: 0603; Case-Metric: 1608; Power: 0.1 W; Technology: SMT; Tolerance: 5 %
R4 R6 = CMP-1012-00103-1: 16K 0.1W 5% 0603 (1608 Metric)  SMD; Value: 16000.00 Ohm; Case-EIA: 0603; Case-Metric: 1608; Tolerance: 5 %; Technology: SMT; Power: 0.1 W
R5 = CMP-1012-00046-1: 68R 0.1W 5% 0603 (1608 Metric)  SMD; Case-EIA: 0603; Value: 68.00 Ohm; Case-Metric: 1608; Power: 0.1 W; Technology: SMT; Tolerance: 5 %
R11 R12 R30 = CMP-1012-00058-1: as R17 on sheet Eth-Crystal; Technology: SMT; Power: 0.1 W; Tolerance: 5 %
R29 R31-R33 R35-R38 = CMP-1012-00098-1: as R1 on sheet Power; Technology: SMT; Tolerance: 5 %; Power: 0.1 W
U10 = RT9728A: BD2242G-GTR; Supplier 1: Digi-Key; Supplier Part Number 1: BD2242G-GCT-ND
U13-U15 = CMP-1066-00052-1: 4-Channel EMI Filter with Integrated ESD Protection, -40 to 85 degC, 8-Pin UDFN, Pb-Free, Tape and Reel; Manufacturer: On Semiconductor; VRWM Max (V): 5; V(BR) Typ (V): 7; Number of Lines: 4; ComponentLink2Description: Datasheet; ComponentLink1URL: http://www.onsemi.com/; DatasheetVersion: Rev. 7; PackageVersion: Rev. D, 10/2012; Mounting Technology: Surface Mount; ComponentLink3Description: Package Specification; PartNumber: NUF4001MUT2G; ComponentLink2URL: http://www.onsemi.cn/pub_link/Collateral/NUF4001MU-D.PDF; Packing: Tape and Reel; PackageReference: UDFN-8-517AD; ComponentLink1Description: Manufacturer URL; RoHS: Pb-Free; ComponentLink3URL: http://www.onsemi.com/pub_link/Collateral/517AD.PDF; PackageDescription: 8-Pin Small Outline No-Lead, Body 1.8 x 1.2 mm, Pitch 0.4 mm
U35 = CMP-0315-00083-1: 3.3V CAN Transceiver with Sleep Mode, 6 mA, -40 to 125 degC, 8-pin SOIC (D), Green (RoHS & no Sb/Br); Manufacturer: Texas Instruments; Receivers Per Package: 1; ICC(Max)(mA): 6; Bus Fault Voltage(V): +/-30; Supply Voltage(s)(V): 3.3; Rating: Catalog; Transient Pulse Protection(V): -100 to 100; PartNumber: SN65HVD234D; SubFamily: CAN; DatasheetVersion: SLLS557F; Mounting Technology: Surface Mount; Eco-Plan: Green (RoHS & no Sb/Br); PackageVersion: revM, Jun-2011; PackageReference: D8; ComponentLink1Description: Datasheet; Drivers Per Package: 1; Isolated: No; ComponentLink1URL: http://www.ti.com/general/docs/lit/getliterature.tsp?genericPartNumber=SN65HVD234&fileType=pdf; PackageDescription: 8-Pin Plastic Small Outline Integrated Circuit, 4.9 x 3.9 mm, Pitch 1.27 mm Pitch; Code_JEDEC: MS-012AA; Low Power Mode: Sleep; Footprint: PCA82C250, excludes pin5

## Nets that join several sheets
3V3: buttonInput (JP8.4), Power (25 pins), Eth-Crystal (8 pins), io (15 pins)
5V: Power (11 pins), io (7 pins)
AUX_GND: Power (U8.5 U8.6 U8.7 U8.8), io (D9.2 J3.3)
EXT_GND: Power (U11.5 U11.6 U11.7 U11.8), io (D7.2 J5.3)
GND: buttonInput (6 pins), Micro (8 pins), Power (49 pins), Eth-Crystal (18 pins), io (24 pins)
SOL_GND: Power (U36.5 U36.6 U36.7 U36.8), io (D8.2 J6.2)
ACT-LED: Micro (U1.63), Eth-Crystal (R18.2)
AUX_1: Micro (U1.107), io (U13.8)
AUX_2: Micro (U1.108), io (U13.7)
AUX_EN: Micro (U1.111), Power (R26.2 U8.4)
CAN RX: Micro (U1.33), io (U35.4)
CAN TX: Micro (U1.34), io (U35.1)
EN0LED2: Micro (U1.62), Eth-Crystal (R34.2)
EXT_1: Micro (U1.110), io (U13.5)
EXT_2: Micro (U1.109), io (U13.6)
EXT_EN: Micro (U1.112), Power (R27.2 U11.4)
~{FAULT}: Micro (U1.41), io (D6.2 R4.1 U10.4)
I2C5CLK: Micro (U1.1), io (R32.1 U15.4)
I2C5SDA: Micro (U1.2), io (R33.1 U15.3)
I2C8CLK: Micro (U1.3), io (R37.1 U15.2)
I2C8SDA: Micro (U1.4), io (R38.1 U15.1)
LINK-LED: Micro (U1.61), Eth-Crystal (R17.2)
MC1: buttonInput (U5.5), Micro (U1.32)
MC2: buttonInput (U6.6), Micro (U1.25)
MC3: buttonInput (U5.6), Micro (U1.31)
MC4: buttonInput (U6.5), Micro (U1.24)
MC5: buttonInput (U5.7), Micro (U1.30)
MC6: buttonInput (U6.4), Micro (U1.23)
MC7: buttonInput (U5.8), Micro (U1.29)
MC8: buttonInput (U6.3), Micro (U1.22)
MC9: buttonInput (U6.1), Micro (U1.27)
MC10: buttonInput (U6.2), Micro (U1.21)
MC11: buttonInput (U6.7), Micro (U1.20)
MC12: buttonInput (U7.8), Micro (U1.13)
MC13: buttonInput (U6.8), Micro (U1.19)
MC14: buttonInput (U7.7), Micro (U1.12)
MC15: buttonInput (U7.1), Micro (U1.18)
MC16: buttonInput (U7.6), Micro (U1.11)
MC17: buttonInput (U7.2), Micro (U1.15)
MC18: buttonInput (U7.5), Micro (U1.6)
MC19: buttonInput (U7.3), Micro (U1.14)
MC20: buttonInput (U7.4), Micro (U1.5)
MC21: buttonInput (U9.1), Micro (U1.128)
MC22: buttonInput (U12.8), Micro (U1.121)
MC23: buttonInput (U9.2), Micro (U1.127)
MC24: buttonInput (U12.6), Micro (U1.120)
MC25: buttonInput (U9.4), Micro (U1.126)
MC26: buttonInput (U12.4), Micro (U1.119)
MC27: buttonInput (U9.6), Micro (U1.125)
MC28: buttonInput (U12.2), Micro (U1.118)
MC29: buttonInput (U9.8), Micro (U1.124)
MC30: buttonInput (U12.1), Micro (U1.117)
~{RST}: Eth-Crystal (6 pins), io (J9.3)
SOL_EN: Micro (U1.116), Power (R28.2 U36.4)
TCK: Micro (U1.100), io (J9.4 R29.1)
TDI: Micro (U1.98), io (J9.6 R36.2)
TDO: Micro (U1.97), io (J9.7 R35.2)
TMS: Micro (U1.99), io (J9.5 R31.1)
TRCLK: buttonInput (U5.1), Micro (U1.45)
TRD0: buttonInput (U5.2), Micro (U1.44)
TRD1: buttonInput (U5.3), Micro (U1.43)
TRD2: buttonInput (U5.4), Micro (U1.42)
U3CTS: Micro (U1.106), io (U14.5)
U3RTS: Micro (U1.105), io (U14.8)
U3RX: Micro (U1.37), io (U14.6)
U3TX: Micro (U1.38), io (U14.7)
USB_ID: Micro (U1.95), io (D3.2 L3.1)
USB_N: Micro (U1.93), io (D4.2 L1.1)
USB_P: Micro (U1.94), io (D3.1 L2.1)
USB_VBUS: Micro (U1.96), io (5 pins)
USB_VBUSEN: Micro (U1.40), io (U10.3)

## Assembly variants
HSBNE-INPUT: not fitted J9